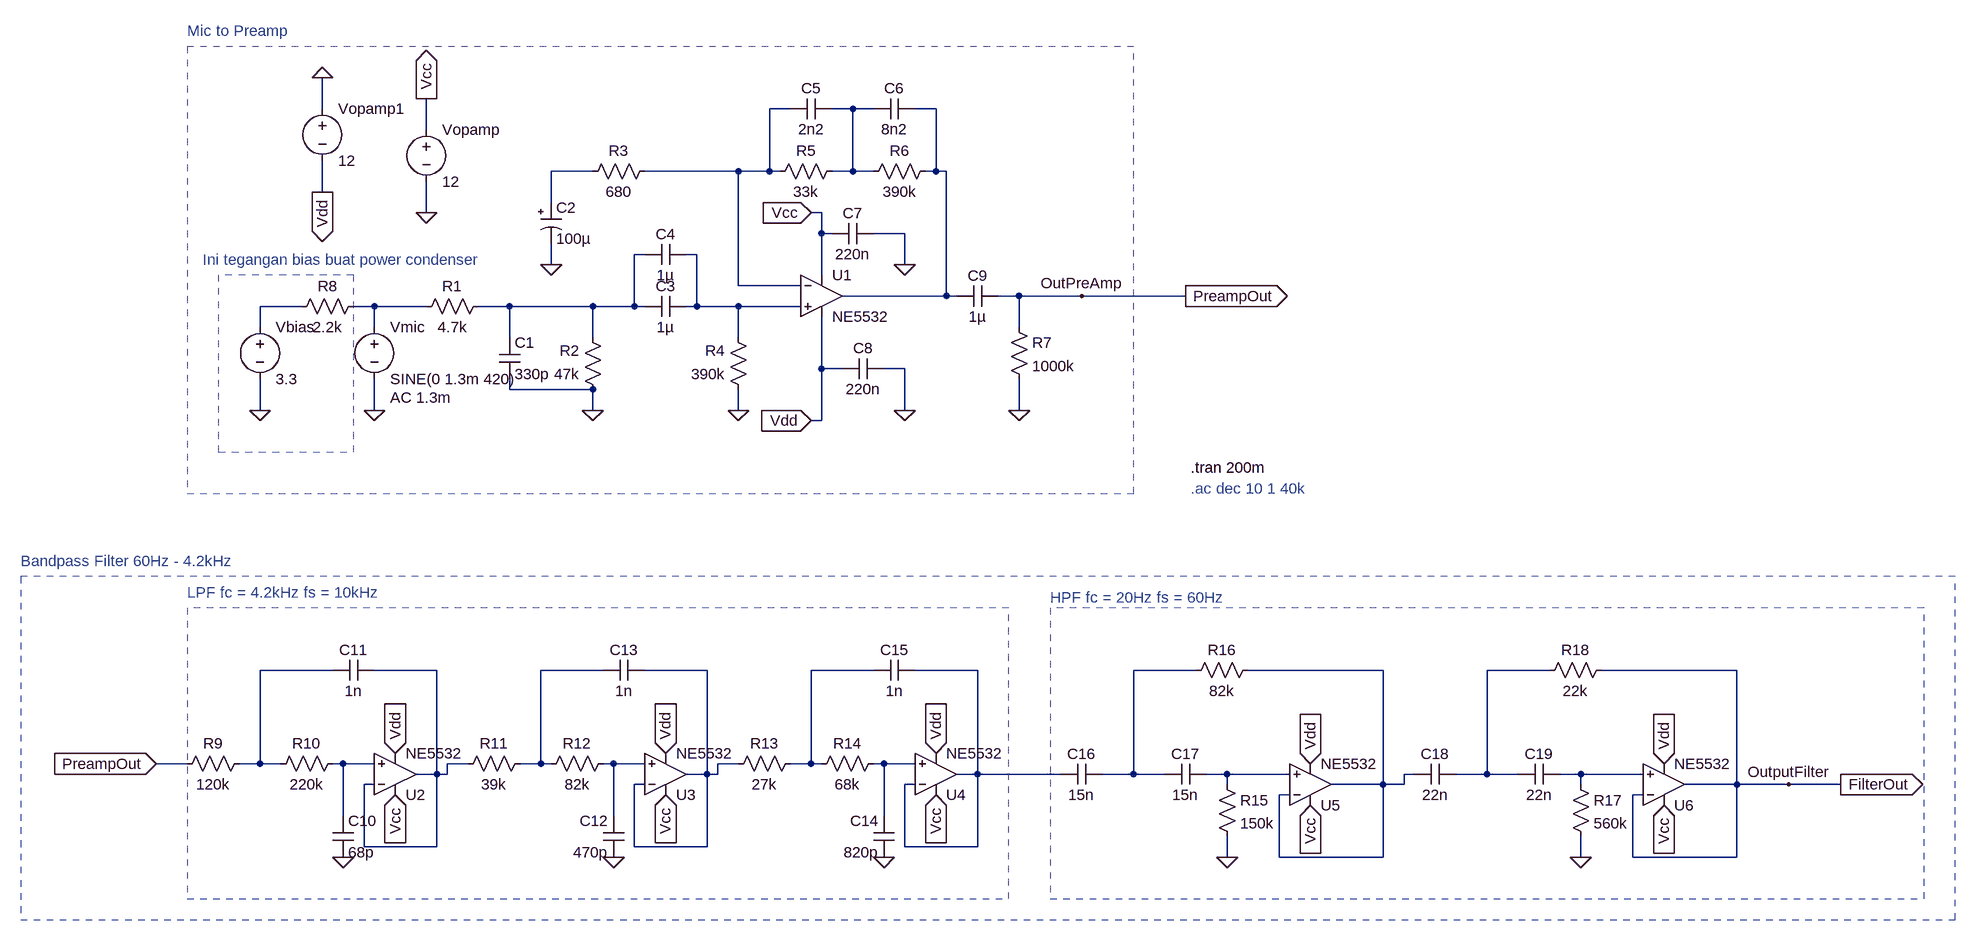
[diagram p0: schematic skematik_preamp.asc]
skematik_preamp.asc, the LTspice schematic file:
Version 4
SHEET 1 2820 964
WIRE 224 -288 224 -336
WIRE 944 -288 912 -288
WIRE 1040 -288 1008 -288
WIRE 1072 -288 1040 -288
WIRE 1168 -288 1136 -288
WIRE 384 -256 384 -304
WIRE 640 -192 576 -192
WIRE 864 -192 720 -192
WIRE 912 -192 912 -288
WIRE 912 -192 864 -192
WIRE 928 -192 912 -192
WIRE 1040 -192 1040 -288
WIRE 1040 -192 1008 -192
WIRE 1072 -192 1040 -192
WIRE 1168 -192 1168 -288
WIRE 1168 -192 1152 -192
WIRE 1184 -192 1168 -192
WIRE 224 -160 224 -208
WIRE 576 -144 576 -192
WIRE 384 -128 384 -176
WIRE 992 -128 976 -128
WIRE 992 -96 992 -128
WIRE 1008 -96 992 -96
WIRE 1120 -96 1072 -96
WIRE 720 -64 704 -64
WIRE 800 -64 784 -64
WIRE 576 -48 576 -80
WIRE 1120 -48 1120 -96
WIRE 992 -32 992 -96
WIRE 864 -16 864 -192
WIRE 960 -16 864 -16
WIRE 1184 0 1184 -192
WIRE 1184 0 1024 0
WIRE 1200 0 1184 0
WIRE 1296 0 1264 0
WIRE 1392 0 1296 0
WIRE 1552 0 1392 0
WIRE 192 16 128 16
WIRE 304 16 272 16
WIRE 384 16 304 16
WIRE 512 16 464 16
WIRE 640 16 512 16
WIRE 704 16 704 -64
WIRE 704 16 640 16
WIRE 720 16 704 16
WIRE 800 16 800 -64
WIRE 800 16 784 16
WIRE 864 16 800 16
WIRE 960 16 864 16
WIRE 128 48 128 16
WIRE 304 48 304 16
WIRE 1296 48 1296 0
WIRE 512 64 512 16
WIRE 640 64 640 16
WIRE 864 64 864 16
WIRE 992 112 992 32
WIRE 1024 112 992 112
WIRE 1120 112 1088 112
WIRE 512 144 512 128
WIRE 640 144 512 144
WIRE 128 176 128 128
WIRE 304 176 304 128
WIRE 640 176 640 144
WIRE 864 176 864 144
WIRE 1120 176 1120 112
WIRE 1296 176 1296 128
WIRE 992 192 992 112
WIRE 992 192 976 192
WIRE 240 576 128 576
WIRE 400 576 304 576
WIRE 656 576 560 576
WIRE 816 576 720 576
WIRE 1072 576 976 576
WIRE 1232 576 1136 576
WIRE 1568 576 1472 576
WIRE 1856 576 1648 576
WIRE 2112 576 2016 576
WIRE 2400 576 2192 576
WIRE 16 720 -32 720
WIRE 128 720 128 576
WIRE 128 720 96 720
WIRE 160 720 128 720
WIRE 256 720 240 720
WIRE 304 720 256 720
WIRE 448 720 416 720
WIRE 560 720 560 576
WIRE 560 720 528 720
WIRE 576 720 560 720
WIRE 672 720 656 720
WIRE 720 720 672 720
WIRE 864 720 832 720
WIRE 976 720 976 576
WIRE 976 720 944 720
WIRE 992 720 976 720
WIRE 1088 720 1072 720
WIRE 1136 720 1088 720
WIRE 400 736 400 576
WIRE 400 736 368 736
WIRE 416 736 416 720
WIRE 416 736 400 736
WIRE 816 736 816 576
WIRE 816 736 784 736
WIRE 832 736 832 720
WIRE 832 736 816 736
WIRE 1232 736 1232 576
WIRE 1232 736 1200 736
WIRE 1360 736 1232 736
WIRE 1472 736 1472 576
WIRE 1472 736 1424 736
WIRE 1520 736 1472 736
WIRE 1616 736 1584 736
WIRE 1712 736 1616 736
WIRE 1904 736 1888 736
WIRE 2016 736 2016 576
WIRE 2016 736 1968 736
WIRE 2064 736 2016 736
WIRE 2160 736 2128 736
WIRE 2256 736 2160 736
WIRE 304 752 288 752
WIRE 720 752 704 752
WIRE 1136 752 1120 752
WIRE 1616 752 1616 736
WIRE 1856 752 1856 576
WIRE 1856 752 1776 752
WIRE 1888 752 1888 736
WIRE 1888 752 1856 752
WIRE 2160 752 2160 736
WIRE 2400 752 2400 576
WIRE 2400 752 2320 752
WIRE 2480 752 2400 752
WIRE 2560 752 2480 752
WIRE 1712 768 1696 768
WIRE 2256 768 2240 768
WIRE 256 800 256 720
WIRE 672 800 672 720
WIRE 1088 800 1088 720
WIRE 288 848 288 752
WIRE 400 848 400 736
WIRE 400 848 288 848
WIRE 704 848 704 752
WIRE 816 848 816 736
WIRE 816 848 704 848
WIRE 1120 848 1120 752
WIRE 1232 848 1232 736
WIRE 1232 848 1120 848
WIRE 1616 864 1616 832
WIRE 1696 864 1696 768
WIRE 1856 864 1856 752
WIRE 1856 864 1696 864
WIRE 2160 864 2160 832
WIRE 2240 864 2240 768
WIRE 2400 864 2400 752
WIRE 2400 864 2240 864
FLAG 304 176 0
FLAG 640 176 0
FLAG 864 176 0
FLAG 1120 176 0
FLAG 1296 176 0
FLAG 1120 -48 0
FLAG 576 -48 0
FLAG 976 -128 Vcc
IOPIN 976 -128 In
FLAG 976 192 Vdd
IOPIN 976 192 In
FLAG 384 -304 Vcc
IOPIN 384 -304 Out
FLAG 224 -160 Vdd
IOPIN 224 -160 Out
FLAG 1392 0 OutPreAmp
FLAG 384 -128 0
FLAG 224 -336 0
FLAG 128 176 0
FLAG 256 864 0
FLAG 672 864 0
FLAG 1088 864 0
FLAG 336 768 Vcc
IOPIN 336 768 In
FLAG 752 768 Vcc
IOPIN 752 768 In
FLAG 1168 768 Vcc
IOPIN 1168 768 In
FLAG 336 704 Vdd
IOPIN 336 704 In
FLAG 752 704 Vdd
IOPIN 752 704 In
FLAG 1168 704 Vdd
IOPIN 1168 704 In
FLAG 1552 0 PreampOut
IOPIN 1552 0 Out
FLAG -32 720 PreampOut
IOPIN -32 720 In
FLAG 1616 864 0
FLAG 2160 864 0
FLAG 1744 784 Vcc
IOPIN 1744 784 In
FLAG 1744 720 Vdd
IOPIN 1744 720 In
FLAG 2288 784 Vcc
IOPIN 2288 784 In
FLAG 2288 720 Vdd
IOPIN 2288 720 In
FLAG 2480 752 OutputFilter
FLAG 2560 752 FilterOut
IOPIN 2560 752 Out
SYMBOL res 480 0 R90
WINDOW 0 0 56 VBottom 2
WINDOW 3 32 56 VTop 2
SYMATTR InstName R1
SYMATTR Value 4.7k
SYMBOL res 656 160 R180
WINDOW 0 36 76 Left 2
WINDOW 3 36 40 Left 2
SYMATTR InstName R2
SYMATTR Value 47k
SYMBOL res 736 -208 R90
WINDOW 0 0 56 VBottom 2
WINDOW 3 32 56 VTop 2
SYMATTR InstName R3
SYMATTR Value 680
SYMBOL res 880 160 R180
WINDOW 0 36 76 Left 2
WINDOW 3 36 40 Left 2
SYMATTR InstName R4
SYMATTR Value 390k
SYMBOL res 912 -176 R270
WINDOW 0 32 56 VTop 2
WINDOW 3 0 56 VBottom 2
SYMATTR InstName R5
SYMATTR Value 33k
SYMBOL res 1056 -176 R270
WINDOW 0 32 56 VTop 2
WINDOW 3 0 56 VBottom 2
SYMATTR InstName R6
SYMATTR Value 390k
SYMBOL res 1280 32 R0
SYMATTR InstName R7
SYMATTR Value 1000k
SYMBOL cap 496 64 R0
SYMATTR InstName C1
SYMATTR Value 330p
SYMBOL cap 784 0 R90
WINDOW 0 0 32 VBottom 2
WINDOW 3 32 32 VTop 2
SYMATTR InstName C3
SYMATTR Value 1µ
SYMBOL cap 784 -80 R90
WINDOW 0 0 32 VBottom 2
WINDOW 3 32 32 VTop 2
SYMATTR InstName C4
SYMATTR Value 1µ
SYMBOL cap 1008 -304 R90
WINDOW 0 0 32 VBottom 2
WINDOW 3 32 32 VTop 2
SYMATTR InstName C5
SYMATTR Value 2n2
SYMBOL cap 1136 -304 R90
WINDOW 0 0 32 VBottom 2
WINDOW 3 32 32 VTop 2
SYMATTR InstName C6
SYMATTR Value 8n2
SYMBOL cap 1072 -112 R90
WINDOW 0 0 32 VBottom 2
WINDOW 3 32 32 VTop 2
SYMATTR InstName C7
SYMATTR Value 220n
SYMBOL cap 1088 96 R90
WINDOW 0 0 32 VBottom 2
WINDOW 3 32 32 VTop 2
SYMATTR InstName C8
SYMATTR Value 220n
SYMBOL cap 1264 -16 R90
WINDOW 0 0 32 VBottom 2
WINDOW 3 32 32 VTop 2
SYMATTR InstName C9
SYMATTR Value 1µ
SYMBOL voltage 384 -272 R0
SYMATTR InstName Vopamp
SYMATTR Value 12
SYMBOL polcap 560 -144 R0
SYMATTR InstName C2
SYMATTR Value 100µ
SYMATTR SpiceLine V=3
SYMBOL voltage 304 32 R0
WINDOW 123 24 124 Left 2
WINDOW 39 0 0 Left 0
SYMATTR Value2 AC 1.3m
SYMATTR InstName Vmic
SYMATTR Value SINE(0 1.3m 420)
SYMBOL voltage 224 -304 R0
SYMATTR InstName Vopamp1
SYMATTR Value 12
SYMBOL voltage 128 32 R0
SYMATTR InstName Vbias
SYMATTR Value 3.3
SYMBOL res 288 0 R90
WINDOW 0 0 56 VBottom 2
WINDOW 3 32 56 VTop 2
SYMATTR InstName R8
SYMATTR Value 2.2k
SYMBOL res 112 704 R90
WINDOW 0 0 56 VBottom 2
WINDOW 3 32 56 VTop 2
SYMATTR InstName R9
SYMATTR Value 120k
SYMBOL res 256 704 R90
WINDOW 0 0 56 VBottom 2
WINDOW 3 32 56 VTop 2
SYMATTR InstName R10
SYMATTR Value 220k
SYMBOL cap 240 800 R0
SYMATTR InstName C10
SYMATTR Value 68p
SYMBOL cap 304 560 R90
WINDOW 0 0 32 VBottom 2
WINDOW 3 32 32 VTop 2
SYMATTR InstName C11
SYMATTR Value 1n
SYMBOL cap 688 864 R180
WINDOW 0 24 56 Left 2
WINDOW 3 24 8 Left 2
SYMATTR InstName C12
SYMATTR Value 470p
SYMBOL cap 1104 864 R180
WINDOW 0 24 56 Left 2
WINDOW 3 24 8 Left 2
SYMATTR InstName C14
SYMATTR Value 820p
SYMBOL cap 656 592 R270
WINDOW 0 32 32 VTop 2
WINDOW 3 0 32 VBottom 2
SYMATTR InstName C13
SYMATTR Value 1n
SYMBOL cap 1072 592 R270
WINDOW 0 32 32 VTop 2
WINDOW 3 0 32 VBottom 2
SYMATTR InstName C15
SYMATTR Value 1n
SYMBOL res 544 704 R90
WINDOW 0 0 56 VBottom 2
WINDOW 3 32 56 VTop 2
SYMATTR InstName R11
SYMATTR Value 39k
SYMBOL res 672 704 R90
WINDOW 0 0 56 VBottom 2
WINDOW 3 32 56 VTop 2
SYMATTR InstName R12
SYMATTR Value 82k
SYMBOL res 960 704 R90
WINDOW 0 0 56 VBottom 2
WINDOW 3 32 56 VTop 2
SYMATTR InstName R13
SYMATTR Value 27k
SYMBOL res 1088 704 R90
WINDOW 0 0 56 VBottom 2
WINDOW 3 32 56 VTop 2
SYMATTR InstName R14
SYMATTR Value 68k
SYMBOL ZZZ\\OpAmp\\NE5532 992 0 R0
SYMATTR InstName U1
SYMBOL ZZZ\\OpAmp\\NE5532 336 736 M180
SYMATTR InstName U2
SYMBOL ZZZ\\OpAmp\\NE5532 752 736 M180
SYMATTR InstName U3
SYMBOL ZZZ\\OpAmp\\NE5532 1168 736 M180
SYMATTR InstName U4
SYMBOL cap 1424 720 R90
WINDOW 0 0 32 VBottom 2
WINDOW 3 32 32 VTop 2
SYMATTR InstName C16
SYMATTR Value 15n
SYMBOL cap 1584 720 R90
WINDOW 0 0 32 VBottom 2
WINDOW 3 32 32 VTop 2
SYMATTR InstName C17
SYMATTR Value 15n
SYMBOL res 1600 736 R0
SYMATTR InstName R15
SYMATTR Value 150k
SYMBOL res 1664 560 R90
WINDOW 0 0 56 VBottom 2
WINDOW 3 32 56 VTop 2
SYMATTR InstName R16
SYMATTR Value 82k
SYMBOL ZZZ\\OpAmp\\NE5532 1744 752 M180
SYMATTR InstName U5
SYMBOL cap 1968 720 R90
WINDOW 0 0 32 VBottom 2
WINDOW 3 32 32 VTop 2
SYMATTR InstName C18
SYMATTR Value 22n
SYMBOL cap 2128 720 R90
WINDOW 0 0 32 VBottom 2
WINDOW 3 32 32 VTop 2
SYMATTR InstName C19
SYMATTR Value 22n
SYMBOL res 2144 736 R0
SYMATTR InstName R17
SYMATTR Value 560k
SYMBOL res 2208 560 R90
WINDOW 0 0 56 VBottom 2
WINDOW 3 32 56 VTop 2
SYMATTR InstName R18
SYMATTR Value 22k
SYMBOL ZZZ\\OpAmp\\NE5532 2288 752 M180
SYMATTR InstName U6
TEXT 1560 264 Left 2 !.tran 200m
TEXT 40 -56 Left 2 ;Ini tegangan bias buat power condenser
TEXT 16 -408 Left 2 ;Mic to Preamp
TEXT 16 456 Left 2 ;LPF fc = 4.2kHz fs = 10kHz
TEXT 1344 464 Left 2 ;HPF fc = 20Hz fs = 60Hz
TEXT -240 408 Left 2 ;Bandpass Filter 60Hz - 4.2kHz
TEXT 1560 296 Left 2 ;.ac dec 10 1 40k
RECTANGLE Normal 272 -32 64 240 2
RECTANGLE Normal 1472 -384 16 304 1
RECTANGLE Normal 1280 480 16 928 3
RECTANGLE Normal 2688 480 1344 928 3
RECTANGLE Normal 2736 432 -240 960 1

The netlist it stands for:
* skematik_preamp.asc
R1 N005 N008 4.7k
R2 0 N005 47k
R3 N001 N004 680
R4 0 N006 390k
R5 N001 N002 33k
R6 N002 N003 390k
R7 PreampOut 0 1000k
C1 N005 0 330p
C3 N006 N005 1µ
C4 N006 N005 1µ
C5 N002 N001 2n2
C6 N003 N002 8n2
C7 0 Vcc 220n
C8 0 Vdd 220n
C9 PreampOut N003 1µ
Vopamp Vcc 0 12
C2 N004 0 100µ V=3
Vmic N008 0 SINE(0 1.3m 420) AC 1.3m
Vopamp1 0 Vdd 12
Vbias N007 0 3.3
R8 N008 N007 2.2k
R9 N009 PreampOut 120k
R10 N018 N009 220k
C10 N018 0 68p
C11 N010 N009 1n
C12 0 N019 470p
C14 0 N020 820p
C13 N011 N012 1n
C15 N013 N014 1n
R11 N011 N010 39k
R12 N019 N011 82k
R13 N013 N012 27k
R14 N020 N013 68k
XU1 N006 N001 Vcc Vdd N003 NE5532  ; pins In+ In- V+ V- OUT
XU2 N018 N010 Vcc Vdd N010 NE5532  ; pins In+ In- V+ V- OUT
XU3 N019 N012 Vcc Vdd N012 NE5532  ; pins In+ In- V+ V- OUT
XU4 N020 N014 Vcc Vdd N014 NE5532  ; pins In+ In- V+ V- OUT
C16 N015 N014 15n
C17 N021 N015 15n
R15 N021 0 150k
R16 N016 N015 82k
XU5 N021 N016 Vcc Vdd N016 NE5532  ; pins In+ In- V+ V- OUT
C18 N017 N016 22n
C19 N022 N017 22n
R17 N022 0 560k
R18 FilterOut N017 22k
XU6 N022 FilterOut Vcc Vdd FilterOut NE5532  ; pins In+ In- V+ V- OUT
.tran 200m
* Ini tegangan bias buat power condenser
* Mic to Preamp
* LPF fc = 4.2kHz fs = 10kHz
* HPF fc = 20Hz fs = 60Hz
* Bandpass Filter 60Hz - 4.2kHz
* .ac dec 10 1 40k
.backanno
.end